# Altium project PCB_Project2.PrjPCB
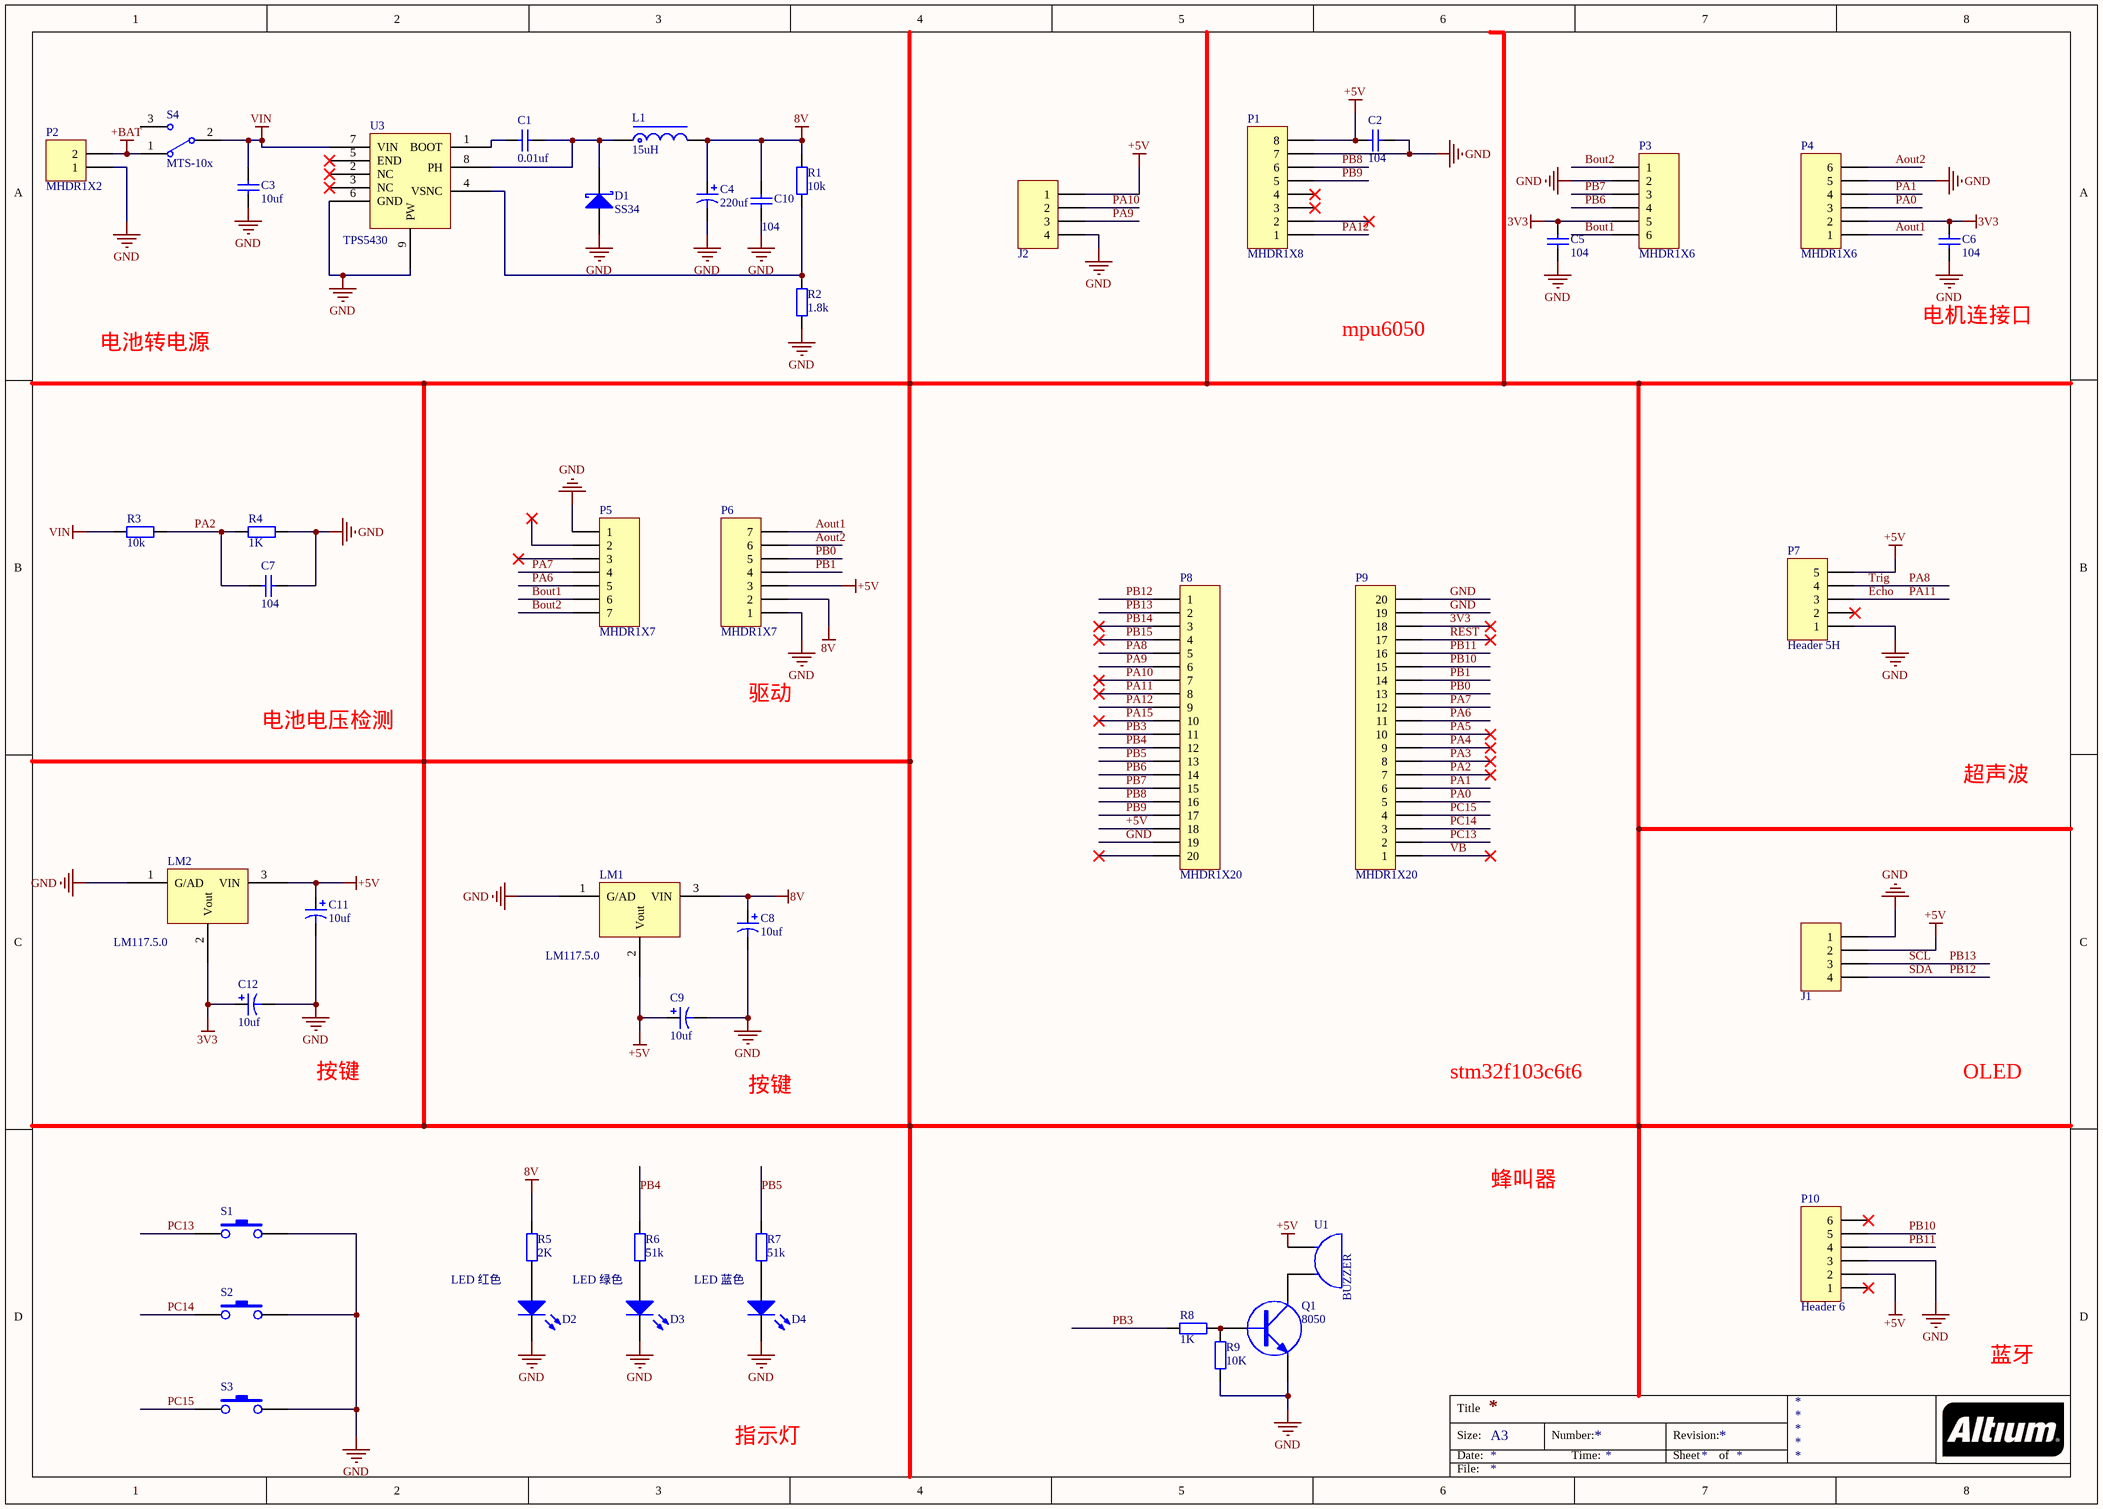
[diagram p0: Sheet2.SchDoc]
1 sheet, 47 parts. Net scope: global (net labels, ports and power ports of the same name join across sheets).
Board file: PCB2.PcbDoc

## Sheet Sheet2.SchDoc
size A3

### Parts
C1  0.01uf  [C0805_L]
C2  104  [C0805_L]
C3  10uf  [C0805_L]
C4  220uf  [CS 6*6 - V]
C5  104  [C0603_L]
C6  104  [C0603_L]
C7  104  [C0603_L]
C8  10uf  [C0805_L]
C9  10uf  [C0805_L]
C10  104  [C0603_L]
C11  10uf  [C0805_L]
C12  10uf  [C0805_L]
D1  SS34  [SMA]
D2  LED 红色  [LED0603_W]
D3  LED 绿色  [LED0603_W]
D4  LED 蓝色  [LED0603_W]
J1  超声波  [OLED]  (value not drawn)
J2  超声波  [HDR2.54-LI-4P]  (value not drawn)
L1  15uH  [IND-SMD_L12.5-W12.5_RLF12545T]
LM1  LM117.5.0  [SOT-223]
LM2  LM117.5.0  [SOT-223]
P1  MHDR1X8  [HDR2.54-M-LI-8P]
P2  MHDR1X2  [KF128-5.08-2P]
P3  MHDR1X6  [XH2.54-LI-6P]
P4  MHDR1X6  [XH2.54-LI-6P]
P5  MHDR1X7  [HDR2.54-M-LI-7P]
P6  MHDR1X7  [HDR2.54-M-LI-7P]
P7  Header 5H  [HDR2.54-M-LI-5P]
P8  MHDR1X20  [HDR2.54-M-LI-20P]
P9  MHDR1X20  [HDR2.54-M-LI-20P]
P10  Header 6  [HDR2.54-M-LI-6P]
Q1  8050  [SOT23]
R1  10k  [R0805_L]
R2  1.8k  [R0805_L]
R3  10k  [R0805_L]
R4  1K  [R0805_L]
R5  2K  [R0805_L]
R6  51k  [R0805_L]
R7  51k  [R0805_L]
R8  1k  [R0805_L]
R9  10k  [R0805_L]
S1  (no value)  [SW-SMD1]
S2  (no value)  [SW-SMD1]
S3  (no value)  [SW-SMD1]
S4  MTS-10x  [SW-TH_SS-12D10L9]
U1  BUZZER  [Buzzer]
U3  TPS5430  [SOP-8_L4.9-W3.9-P1.27-LS6.0-BL-EP]

### Nets
3V3: C5.1 C6.1 C12.1 LM2.2(Vout) P3.5 P4.2 P9.18
8V: C4.1 C8.1 C10.2 L1.2 LM1.3(VIN) P6.2 R1.2 R5.2
+5V: C2.2 C9.1 C11.1 J1.2 J2.1 LM1.2(Vout) LM2.3(VIN) P1.8 P6.3 P7.5 P8.18 P10.2 U1.1(A)
+BAT: P2.2 S4.1
GND: C2.1 C3.1 C4.2 C5.2 C6.2 C7.1 C8.2 C9.2 C10.1 C11.2 C12.2 D1.1(A) D2.2(K) D3.2(K) D4.2(K) J1.1 J2.4 LM1.1(G/AD) LM2.1(G/AD) P1.7 P2.1 P3.2 P4.5 P5.1 P6.1 P7.1 P8.19 P9.19 P9.20 P10.3 Q1.2(E) R2.1 R4.2 R9.1 S1.2 S2.2 S3.2 U3.6(GND) U3.9(PW)
VIN: C3.2 R3.1 S4.2 U3.7(VIN)
Aout1: P4.1 P6.7
Aout2: P4.6 P6.6
Bout1: P3.6 P5.6
Bout2: P3.1 P5.7
Echo: P7.3 P8.8  [also labelled PA11]
PA0: P4.3 P9.5
PA1: P4.4 P9.6
PA2: C7.2 P9.7 R3.2 R4.1
PA3: P9.8
PA4: P9.9
PA5: P9.10
PA6: P5.5 P9.11
PA7: P5.4 P9.12
PA8: P7.4 P8.5  [also labelled Trig]
PA9: J2.3 P8.6
PA10: J2.2 P8.7
PA12: P1.1 P8.9
PA15: P8.10
PB0: P6.5 P9.13
PB1: P6.4 P9.14
PB3: P8.11 R8.1
PB4: P8.12 R6.2
PB5: P8.13 R7.2
PB6: P3.4 P8.14
PB7: P3.3 P8.15
PB8: P1.6 P8.16
PB9: P1.5 P8.17
PB10: P9.15 P10.5
PB11: P9.16 P10.4
PB12: J1.4 P8.1  [also labelled SDA]
PB13: J1.3 P8.2  [also labelled SCL]
PB14: P8.3
PB15: P8.4
PC13: P9.2 S1.1
PC14: P9.3 S2.1
PC15: P9.4 S3.1
REST: P9.17
VB: P9.1
NetC1_1: C1.1 D1.2(K) L1.1 U3.8(PH)
NetC1_2: C1.2 U3.1(BOOT)
NetD2_1: D2.1(A) R5.1
NetD3_1: D3.1(A) R6.1
NetD4_1: D4.1(A) R7.1
NetQ1_1: Q1.1(B) R8.2 R9.2
NetQ1_3: Q1.3(C) U1.2(B)
NetR1_1: R1.1 R2.2 U3.4(VSNC)

Not connected (* = marked no-connect by the designer): P1 2* 3* 4*; P5 2* 3*; P7 2*; P8 20*; P10 1* 6*; S4 3; U3 2(NC)* 3(NC)* 5(END)*

### Notes on the sheet
- 电池转电源
- mpu6050
- 电机连接口
- 驱动
- 电池电压检测
- 超声波
- 按键
- stm32f103c6t6
- OLED
- 蜂叫器
- 蓝牙
- 指示灯
- Title
- Size:
- Date:
- A3
- Number:
- Time:
- Revision:
- Sheet
- of
- File:

### Library data of the parts
C1-C3 C5-C7 C10 = Cap Semi: Capacitor (Semiconductor SIM Model); Value: 100pF; Published: 8-Jun-2000; LatestRevisionDate: 29-May-2009; LatestRevisionNote: IPC-7351 Footprint Added.; PackageReference: C1206; Publisher: Altium Limited; PackageDescription: Chip Capacitor
C4 C8 C9 C11 C12 = Cap Pol1: Polarized Capacitor (Radial); Value: 100pF; Published: 8-Jun-2000; LatestRevisionDate: 17-Jul-2002; LatestRevisionNote: Re-released for DXP Platform.; PackageReference: RB7.6-15; Publisher: Altium Limited; PackageDescription: Polarized Capacitor (Radial); 2 Leads
D1 = SS34: 肖特基二极管; 属性: 40V/3A; 联系卖家，免费查找封装: 唯一出售店铺网址https://shop463601444.taobao.com; BOM名称: 肖特基二极管
D2-D4 = LED: 发光二极管; 封装库来自淘宝卖家 ID：黄晶宝石: 其他店铺购入均为假冒，请立即申请退款，本店奖励现金5~20元
J1 J2 = Header 4: LatestRevisionDate: 17-Jul-2002; LatestRevisionNote: Re-released for DXP Platform.; Publisher: Altium Limited
L1 = L-CD: 贴片功率电感; BOM名称: 功率电感; 版权归属: 源创客; 学习资源: www.ooocke.com
P1 = MHDR1X8: Header, 8-Pin; LatestRevisionDate: 17-Jul-2002; LatestRevisionNote: Re-released for DXP Platform.; Publisher: Altium Limited
P2 = MHDR1X2: Header, 2-Pin; LatestRevisionDate: 17-Jul-2002; LatestRevisionNote: Re-released for DXP Platform.; Publisher: Altium Limited
P3 P4 = MHDR1X6: Header, 6-Pin; LatestRevisionDate: 17-Jul-2002; LatestRevisionNote: Re-released for DXP Platform.; Publisher: Altium Limited
P5 P6 = MHDR1X7: Header, 7-Pin; LatestRevisionDate: 17-Jul-2002; LatestRevisionNote: Re-released for DXP Platform.; Publisher: Altium Limited
P7 = Header 5H: Header, 5-Pin, Right Angle; LatestRevisionDate: 17-Jul-2002; LatestRevisionNote: Re-released for DXP Platform.; Publisher: Altium Limited
P8 P9 = MHDR1X20: Header, 20-Pin; LatestRevisionDate: 17-Jul-2002; LatestRevisionNote: Re-released for DXP Platform.; Publisher: Altium Limited
P10 = Header 6: Header, 6-Pin; LatestRevisionDate: 17-Jul-2002; LatestRevisionNote: Re-released for DXP Platform.; Publisher: Altium Limited
Q1 = NPN: NPN Transistor; value: 8550
R1-R3 R5-R7 = Res2: Resistor; Value: 1K; Published: 8-Jun-2000; LatestRevisionDate: 17-Jul-2002; LatestRevisionNote: Re-released for DXP Platform.; PackageReference: AXIAL-0.4; Publisher: Altium Limited; PackageDescription: Axial Device, Thru-Hole; 2 Leads; 0.4 in Pin Spacing
R4 R8 R9 = Res2: Resistor; Published: 8-Jun-2000; LatestRevisionDate: 17-Jul-2002; LatestRevisionNote: Re-released for DXP Platform.; PackageReference: AXIAL-0.4; Publisher: Altium Limited
  R4: PackageDescription: Axial Device, Thru-Hole; 2 Leads; 0.4 in Pin Spacing; Value: 1K
  R8: Value: 1K
  R9: Value: 10K
S1-S3 = 微动开关
S4 = MTS-10x: MTS10x系列3脚扭子开关; 版权归属: 源创客; BOM名称: MTS10x系列3脚扭子开关; 学习资源: www.ooocke.com